# Altium schematic sheet 7688_kernel.SchDoc
size Legal
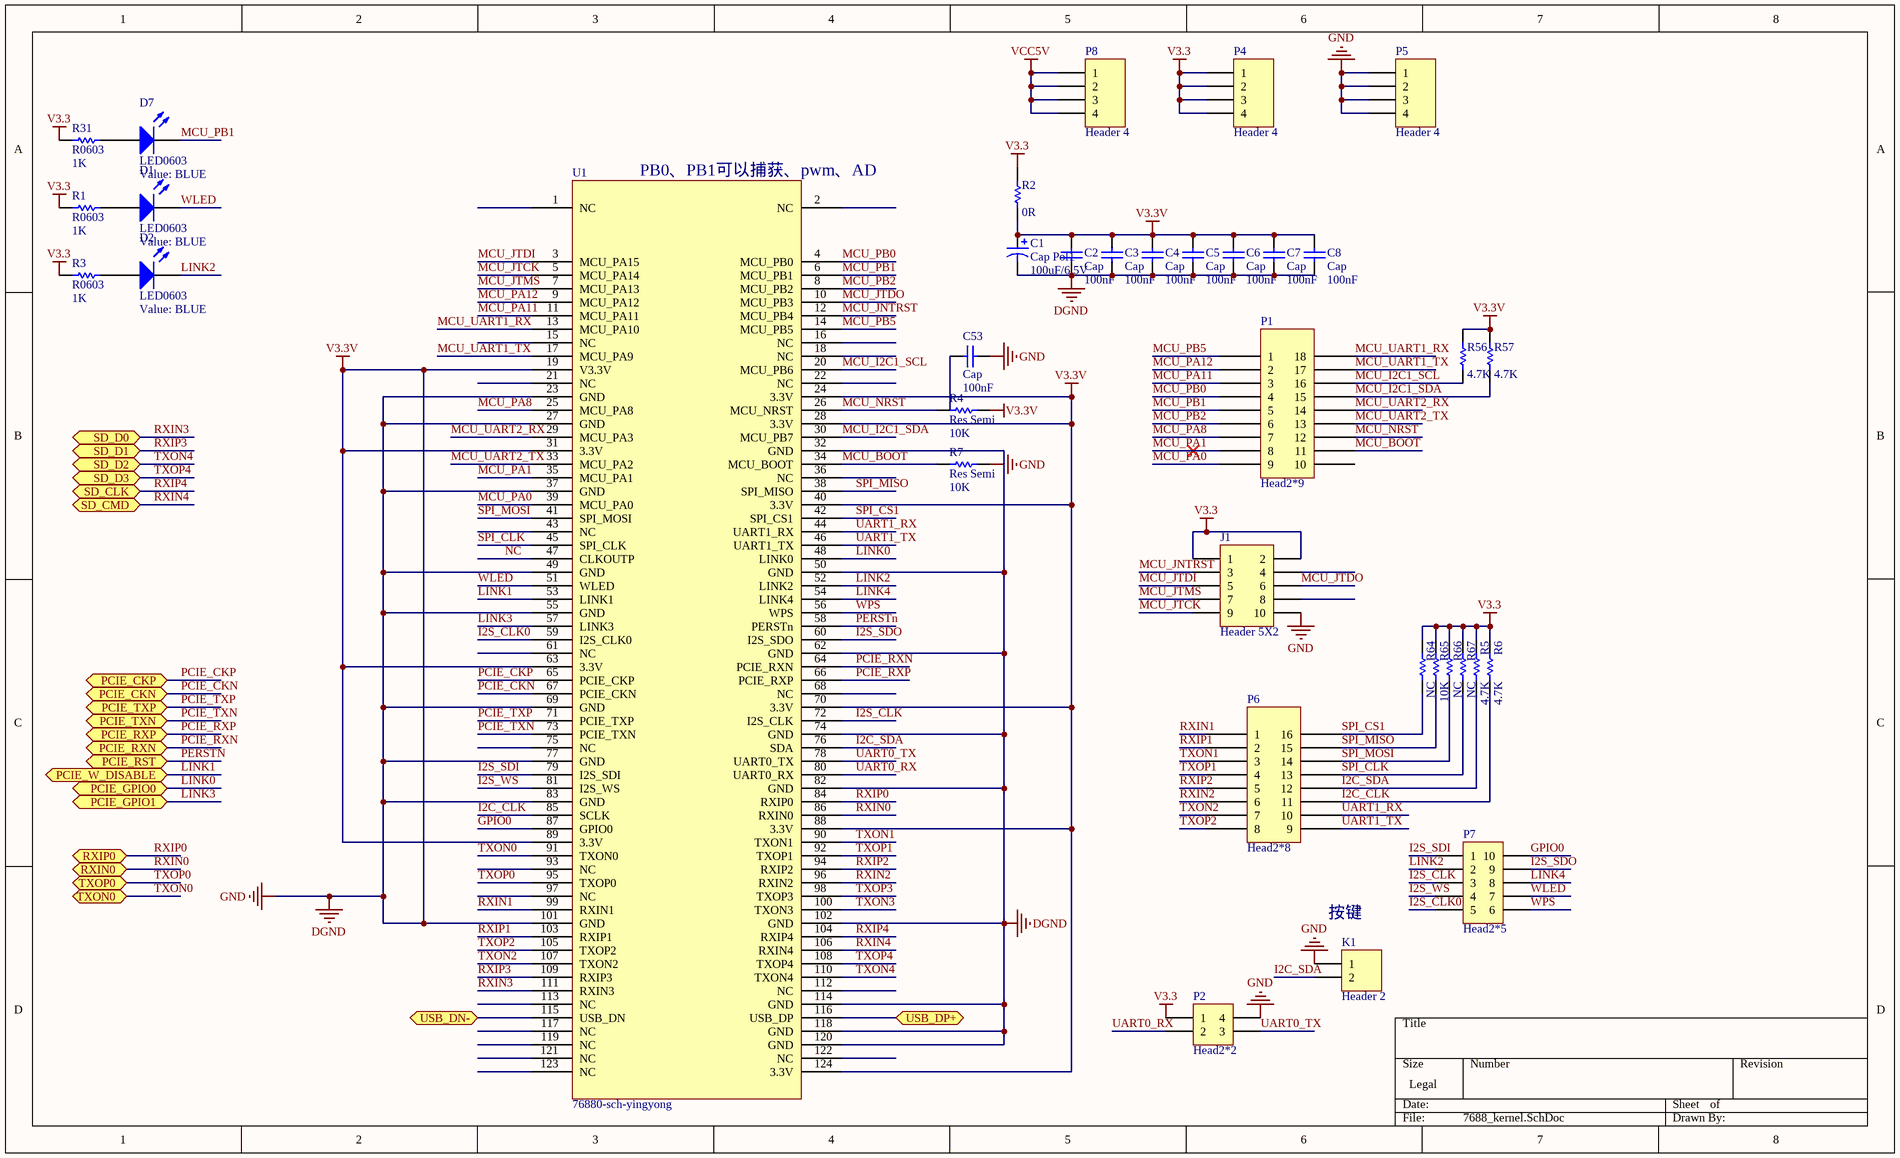
[diagram p0: 7688_kernel.SchDoc]

## Parts
C1  Cap Pol1  value 100uF/6.5V  [C1210-A]
C2  Cap  value 100nF  [R0603N]
C3  Cap  value 100nF  [R0603N]
C4  Cap  value 100nF  [R0603N]
C5  Cap  value 100nF  [R0603N]
C6  Cap  value 100nF  [R0603N]
C7  Cap  value 100nF  [R0603N]
C8  Cap  value 100nF  [R0603N]
C53  Cap  value 100nF  [R0603N]
D1  LED0603  value BLUE  [LED0603]
D2  LED0603  value BLUE  [LED0603]
D7  LED0603  value BLUE  [LED0603]
J1  Header 5X2  [JTAG-10PIN]
K1  Header 2  [3*6key]
P1  Head2*9  [Head2*9-tie]
P2  Head2*2  [Head2*2-tie]
P4  Header 4  [HDR1X4]
P5  Header 4  [HDR1X4]
P6  Head2*8  [Head2*8_tie]
P7  Head2*5  [Head2*5-tie]
P8  Header 4  [HDR1X4]
R1  R0603  value 1K  [R0603N]
R2  value 0R  [R0805N]
R3  R0603  value 1K  [R0603N]
R4  Res Semi  value 10K  [R0603N]
R5  value 4.7K  [R0603N]
R6  value 4.7K  [R0603N]
R7  Res Semi  value 10K  [R0603N]
R31  R0603  value 1K  [R0603N]
R56  value 4.7K  [R0603N]
R57  value 4.7K  [R0603N]
R64  value NC  [R0603N]
R65  value 10K  [R0603N]
R66  value NC  [R0603N]
R67  value NC  [R0603N]
U1  76880-sch-yingyong  [MINI-PCI-BZ]

## Ports
PCIE_CKN, PCIE_CKP, PCIE_GPIO0, PCIE_GPIO1, PCIE_RST, PCIE_RXN, PCIE_RXP, PCIE_TXN, PCIE_TXP, PCIE_W_DISABLE, RXIN0, RXIP0, SD_CLK, SD_CMD, SD_D0, SD_D1, SD_D2, SD_D3, TXON0, TXOP0, USB_DN-, USB_DP+

## Nets
DGND: C1.1 C1.2 C2.1 C2.2 C3.1 C3.2 C4.1 C4.2 C5.1 C5.2 C6.1 C6.2 C7.1 C7.2 C8.1 C8.2 C53.2 J1.10 K1.1 P2.4 P5.1 P5.2 P5.3 P5.4 R2.1 R4.2 R7.2 R56.2 R57.2 U1.19(V3.3V) U1.23(GND) U1.24(3.3V) U1.27(GND) U1.28(3.3V) U1.31(3.3V) U1.32(GND) U1.37(GND) U1.40(3.3V) U1.49(GND) U1.50(GND) U1.55(GND) U1.62(GND) U1.63(3.3V) U1.69(GND) U1.70(3.3V) U1.74(GND) U1.77(GND) U1.82(GND) U1.83(GND) U1.88(3.3V) U1.89(3.3V) U1.101(GND) U1.102(GND) U1.114(GND) U1.118(GND) U1.120(GND) U1.124(3.3V)  [also labelled GND, V3.3V]
V3.3: J1.1 J1.2 P2.1 P4.1 P4.2 P4.3 P4.4 R1.1 R2.2 R3.1 R5.2 R6.2 R31.1 R64.2 R65.2 R66.2 R67.2
VCC5V: P8.1 P8.2 P8.3 P8.4
GPIO0: P7.10 U1.87(GPIO0)
I2C_CLK: P6.11 R6.1 U1.85(SCLK)
I2C_SDA: K1.2 P6.12 R5.1 U1.76(SDA)
I2S_CLK: P7.3 U1.72(I2S_CLK)
I2S_CLK0: P7.5 U1.59(I2S_CLK0)
I2S_SDI: P7.1 U1.79(I2S_SDI)
I2S_SDO: P7.9 U1.60(I2S_SDO)
I2S_WS: P7.4 U1.81(I2S_WS)
LINK0: U1.48(LINK0) ; port PCIE_GPIO0
LINK1: U1.53(LINK1) ; port PCIE_W_DISABLE
LINK2: D2.2 P7.2 U1.52(LINK2)
LINK3: U1.57(LINK3) ; port PCIE_GPIO1
LINK4: P7.8 U1.54(LINK4)
MCU_BOOT: P1.11 R7.1 U1.34(MCU_BOOT)
MCU_I2C1_SCL: P1.16 R56.1 U1.20(MCU_PB6)
MCU_I2C1_SDA: P1.15 R57.1 U1.30(MCU_PB7)
MCU_JNTRST: J1.3 U1.12(MCU_PB4)
MCU_JTCK: J1.9 U1.5(MCU_PA14)
MCU_JTDI: J1.5 U1.3(MCU_PA15)
MCU_JTDO: J1.6 U1.10(MCU_PB3)
MCU_JTMS: J1.7 U1.7(MCU_PA13)
MCU_NRST: P1.12 R4.1 U1.26(MCU_NRST)
MCU_PA0: P1.9 U1.39(MCU_PA0)
MCU_PA1: P1.8 U1.35(MCU_PA1)
MCU_PA8: P1.7 U1.25(MCU_PA8)
MCU_PA11: P1.3 U1.11(MCU_PA11)
MCU_PA12: P1.2 U1.9(MCU_PA12)
MCU_PB0: P1.4 U1.4(MCU_PB0)
MCU_PB1: D7.2 P1.5 U1.6(MCU_PB1)
MCU_PB2: P1.6 U1.8(MCU_PB2)
MCU_PB5: P1.1 U1.14(MCU_PB5)
MCU_UART1_RX: P1.18 U1.13(MCU_PA10)
MCU_UART1_TX: P1.17 U1.17(MCU_PA9)
MCU_UART2_RX: P1.14 U1.29(MCU_PA3)
MCU_UART2_TX: P1.13 U1.33(MCU_PA2)
NC: U1.47(CLKOUTP)
PCIE_CKN: U1.67(PCIE_CKN) ; port PCIE_CKN
PCIE_CKP: U1.65(PCIE_CKP) ; port PCIE_CKP
PCIE_RXN: U1.64(PCIE_RXN) ; port PCIE_RXN
PCIE_RXP: U1.66(PCIE_RXP) ; port PCIE_RXP
PCIE_TXN: U1.73(PCIE_TXN) ; port PCIE_TXN
PCIE_TXP: U1.71(PCIE_TXP) ; port PCIE_TXP
PERSTn: U1.58(PERSTn) ; port PCIE_RST
RXIN0: U1.86(RXIN0) ; port RXIN0
RXIN1: P6.1 U1.99(RXIN1)
RXIN2: P6.6 U1.96(RXIN2)
RXIN3: U1.111(RXIN3) ; port SD_D0
RXIN4: U1.106(RXIN4) ; port SD_CMD
RXIP0: U1.84(RXIP0) ; port RXIP0
RXIP1: P6.2 U1.103(RXIP1)
RXIP2: P6.5 U1.94(RXIP2)
RXIP3: U1.109(RXIP3) ; port SD_D1
RXIP4: U1.104(RXIP4) ; port SD_CLK
SPI_CLK: P6.13 R67.1 U1.45(SPI_CLK)
SPI_CS1: P6.16 R64.1 U1.42(SPI_CS1)
SPI_MISO: P6.15 R65.1 U1.38(SPI_MISO)
SPI_MOSI: P6.14 R66.1 U1.41(SPI_MOSI)
TXON0: U1.91(TXON0) ; port TXON0
TXON1: P6.3 U1.90(TXON1)
TXON2: P6.7 U1.107(TXON2)
TXON3: U1.100(TXON3)
TXON4: U1.110(TXON4) ; port SD_D2
TXOP0: U1.95(TXOP0) ; port TXOP0
TXOP1: P6.4 U1.92(TXOP1)
TXOP2: P6.8 U1.105(TXOP2)
TXOP3: U1.98(TXOP3)
TXOP4: U1.108(TXOP4) ; port SD_D3
UART0_RX: P2.2 U1.80(UART0_RX)
UART0_TX: P2.3 U1.78(UART0_TX)
UART1_RX: P6.10 U1.44(UART1_RX)
UART1_TX: P6.9 U1.46(UART1_TX)
USB_DN-: U1.115(USB_DN) ; port USB_DN-
USB_DP+: U1.116(USB_DP) ; port USB_DP+
WLED: D1.2 P7.7 U1.51(WLED)
WPS: P7.6 U1.56(WPS)
NetD1_1: D1.1 R1.2
NetD2_1: D2.1 R3.2
NetD7_1: D7.1 R31.2

Not connected (* = marked no-connect by the designer): C53 1; J1 4 8; P1 10; U1 1(NC) 2(NC) 15(NC) 16(NC) 18(NC) 21(NC) 22(NC) 36(NC) 43(NC) 61(NC) 68(NC) 75(NC) 93(NC) 97(NC) 112(NC) 113(NC) 117(NC) 119(NC) 121(NC) 122(NC) 123(NC)

## Notes on the sheet
- (near U1) PB0、PB1可以捕获、pwm、AD
- (near K1) 按键

## Library data of the parts
C1 = Cap Pol1: Polarized Capacitor (Radial); Published: 8-Jun-2000; LatestRevisionDate: 17-Jul-2002; LatestRevisionNote: Re-released for DXP Platform.; PackageReference: RB7.6-15; Publisher: Altium Limited
C2-C8 C53 = Cap: Capacitor; Published: 8-Jun-2000; LatestRevisionDate: 17-Jul-2002; LatestRevisionNote: Re-released for DXP Platform.; PackageReference: RAD-0.3; Publisher: Altium Limited
D1 D2 D7 = LED
J1 = Header 5X2: Header, 5-Pin, Dual row; LatestRevisionDate: 17-Jul-2002; LatestRevisionNote: Re-released for DXP Platform.; Publisher: Altium Limited
K1 = Header 2: Header, 2-Pin; LatestRevisionDate: 17-Jul-2002; LatestRevisionNote: Re-released for DXP Platform.; Publisher: Altium Limited
P4 P5 P8 = Header 4: Header, 4-Pin; LatestRevisionDate: 17-Jul-2002; LatestRevisionNote: Re-released for DXP Platform.; Publisher: Altium Limited
R1-R7 R31 R56 R57 R64-R67 = Res Semi: Semiconductor Resistor
  R2 R4-R7 R56 R57 R64-R66: Published: 8-Jun-2000; LatestRevisionDate: 17-Jul-2002; LatestRevisionNote: Re-released for DXP Platform.; PackageReference: AXIAL-0.5; Publisher: Altium Limited
  R67: Published: 8-Jun-2000; LatestRevisionDate: 17-Jul-2002; LatestRevisionNote: Re-released for DXP Platform.; PackageReference: AXIAL-0.5